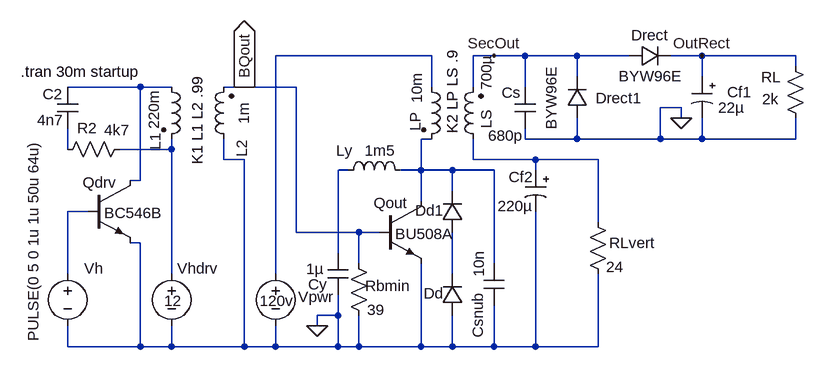
[diagram p0: schematic FlybackTvCtc184.asc]
FlybackTvCtc184.asc, the LTspice schematic file:
Version 4
SHEET 1 880 680
WIRE -1152 -208 -1392 -208
WIRE -1056 -208 -1088 -208
WIRE -1008 -208 -1056 -208
WIRE -928 -208 -1008 -208
WIRE -848 -208 -928 -208
WIRE -736 -208 -784 -208
WIRE -592 -208 -736 -208
WIRE -592 -192 -592 -208
WIRE -928 -176 -928 -208
WIRE -736 -176 -736 -208
WIRE -1600 -160 -1712 -160
WIRE -1552 -160 -1600 -160
WIRE -1440 -160 -1472 -160
WIRE -1360 -160 -1440 -160
WIRE -1152 -160 -1152 -208
WIRE -1088 -160 -1088 -208
WIRE -1008 -160 -1008 -208
WIRE -768 -128 -800 -128
WIRE -768 -112 -768 -128
WIRE -1152 -80 -1168 -80
WIRE -1008 -80 -1008 -96
WIRE -928 -80 -928 -112
WIRE -928 -80 -1008 -80
WIRE -800 -80 -800 -128
WIRE -800 -80 -928 -80
WIRE -736 -80 -736 -112
WIRE -736 -80 -800 -80
WIRE -592 -80 -592 -112
WIRE -592 -80 -736 -80
WIRE -1712 -64 -1712 -96
WIRE -1552 -64 -1552 -80
WIRE -1552 -64 -1632 -64
WIRE -1472 -48 -1472 -80
WIRE -1440 -48 -1472 -48
WIRE -1088 -48 -1088 -80
WIRE -992 -48 -1088 -48
WIRE -896 -48 -992 -48
WIRE -1280 -32 -1296 -32
WIRE -1168 -32 -1168 -80
WIRE -1168 -32 -1200 -32
WIRE -1120 -32 -1168 -32
WIRE -1056 -32 -1120 -32
WIRE -992 -32 -992 -48
WIRE -1600 -16 -1600 -160
WIRE -1600 -16 -1616 -16
WIRE -1120 0 -1120 -32
WIRE -1168 16 -1168 -32
WIRE -1680 32 -1712 32
WIRE -896 48 -896 -48
WIRE -1360 64 -1360 -160
WIRE -1264 64 -1360 64
WIRE -1232 64 -1264 64
WIRE -1600 80 -1616 80
WIRE -1296 96 -1296 -32
WIRE -1264 112 -1264 64
WIRE -1056 112 -1056 -32
WIRE -1712 128 -1712 32
WIRE -1552 128 -1552 -64
WIRE -1392 128 -1392 -208
WIRE -1120 128 -1120 64
WIRE -1296 192 -1296 160
WIRE -1296 192 -1328 192
WIRE -1328 208 -1328 192
WIRE -1712 240 -1712 208
WIRE -1600 240 -1600 80
WIRE -1600 240 -1712 240
WIRE -1552 240 -1552 208
WIRE -1552 240 -1600 240
WIRE -1440 240 -1440 -48
WIRE -1440 240 -1552 240
WIRE -1392 240 -1392 208
WIRE -1392 240 -1440 240
WIRE -1296 240 -1296 192
WIRE -1296 240 -1392 240
WIRE -1264 240 -1264 192
WIRE -1264 240 -1296 240
WIRE -1168 240 -1168 112
WIRE -1168 240 -1264 240
WIRE -1120 240 -1120 192
WIRE -1120 240 -1168 240
WIRE -1056 240 -1056 176
WIRE -1056 240 -1120 240
WIRE -992 240 -992 32
WIRE -992 240 -1056 240
WIRE -896 240 -896 128
WIRE -896 240 -992 240
FLAG -736 -208 OutRect
FLAG -768 -112 0
FLAG -1056 -208 SecOut
FLAG -1440 -160 BQout
IOPIN -1440 -160 Out
FLAG -1328 208 0
SYMBOL voltage -1392 112 M0
WINDOW 0 -62 67 Bottom 0
WINDOW 3 -2 73 Bottom 0
WINDOW 123 41 81 Top 0
SYMATTR InstName Vpwr
SYMATTR Value 120v
SYMATTR SpiceLine Rser=1m Cpar=1m
SYMBOL res -1280 96 R0
WINDOW 0 96 50 Right 0
WINDOW 3 56 87 Right 0
SYMATTR InstName Rbmin
SYMATTR Value 39
SYMATTR SpiceLine tol=1 pwr=0.1
SYMBOL polcap -720 -176 M0
WINDOW 3 -9 48 Right 0
WINDOW 0 -23 24 Right 0
SYMATTR Value 22µ
SYMATTR InstName Cf1
SYMATTR Description Capacitor
SYMATTR Type cap
SYMATTR SpiceLine V=25 Irms=470m Rser=0.16 MTBF=2000 Lser=0 mfg="Nichicon" pn="UPR1E471MPH" type="Al electrolytic" ppPkg=1
SYMBOL cap -1072 112 R0
WINDOW 0 -9 115 VLeft 0
WINDOW 3 -7 21 VLeft 0
SYMATTR InstName Csnub
SYMATTR Value 10n
SYMBOL ind2 -1168 -176 R0
WINDOW 0 -9 55 VRight 0
WINDOW 3 -7 -6 VRight 0
SYMATTR InstName LP
SYMATTR Value 10m
SYMATTR Type ind
SYMATTR SpiceLine Rser=1 Rpar=1430 Cpar=170p
SYMBOL ind2 -1072 -64 R180
WINDOW 0 -4 32 VRight 0
WINDOW 3 -4 91 VRight 0
SYMATTR InstName LS
SYMATTR Value 700µ
SYMATTR Type ind
SYMATTR SpiceLine Rser=.1
SYMBOL diode -848 -192 R270
WINDOW 0 32 32 VTop 0
WINDOW 3 0 32 VBottom 0
SYMATTR InstName Drect
SYMATTR Value BYW96E
SYMBOL npn3 -1232 16 R0
WINDOW 3 24 50 Left 0
WINDOW 0 -9 3 Left 0
SYMATTR Value BU508A
SYMATTR InstName Qout
SYMBOL cap -1024 -160 R0
WINDOW 0 9 9 Right 0
WINDOW 3 13 75 Right 0
SYMATTR InstName Cs
SYMATTR Value 680p
SYMBOL res -608 -208 R0
WINDOW 0 -37 33 Left 0
WINDOW 3 -35 67 Left 0
SYMATTR InstName RL
SYMATTR Value 2k
SYMBOL diode -1104 192 R180
WINDOW 0 29 34 Left 0
WINDOW 3 38 -87 Invisible 0
SYMATTR InstName Dd
SYMATTR Value BYW96E
SYMBOL ind -1296 -16 R270
WINDOW 0 62 10 VBottom 0
WINDOW 3 62 65 VBottom 0
SYMATTR InstName Ly
SYMATTR Value 1m5
SYMATTR SpiceLine Ipk=10 Rser=1 Rpar=100k Cpar=5p
SYMBOL cap -1312 96 R0
WINDOW 0 -30 48 Left 0
WINDOW 3 -33 24 Left 0
SYMATTR InstName Cy
SYMATTR Value 1µ
SYMATTR SpiceLine V=50 Irms=6.038 Rser=0.017 MTBF=0 Lser=0 mfg="KEMET" pn="C1210C105K5RAC" type="X7R" ppPkg=1
SYMBOL ind2 -1568 -176 R0
WINDOW 0 -9 86 VRight 0
WINDOW 3 -11 21 VRight 0
SYMATTR InstName L1
SYMATTR Value 220m
SYMATTR Type ind
SYMATTR SpiceLine Rser=100 Rpar=1430 Cpar=170p
SYMBOL ind2 -1456 -64 R180
WINDOW 0 -12 -12 VRight 0
WINDOW 3 -15 38 VRight 0
SYMATTR InstName L2
SYMATTR Value 1m
SYMATTR Type ind
SYMATTR SpiceLine Rser=1m
SYMBOL npn3 -1680 -16 R0
WINDOW 3 24 50 Left 0
WINDOW 0 -9 3 Left 0
SYMATTR Value BC546B
SYMATTR InstName Qdrv
SYMBOL voltage -1712 112 M0
WINDOW 0 -40 23 Bottom 0
WINDOW 3 68 -35 VBottom 0
WINDOW 123 41 81 Top 0
SYMATTR InstName Vh
SYMATTR Value PULSE(0 5 0 1u 1u 50u 64u)
SYMATTR SpiceLine Rser=1k
SYMBOL cap -1728 -160 R0
WINDOW 0 -22 11 Left 0
WINDOW 3 -31 51 Left 0
SYMATTR InstName C2
SYMATTR Value 4n7
SYMBOL res -1616 -80 R90
WINDOW 0 -1 66 VBottom 0
WINDOW 3 -29 20 VTop 0
SYMATTR InstName R2
SYMATTR Value 4k7
SYMBOL diode -1104 64 R180
WINDOW 0 29 34 Left 0
WINDOW 3 38 -87 Invisible 0
SYMATTR InstName Dd1
SYMATTR Value BYW96E
SYMBOL voltage -1552 112 M0
WINDOW 0 -40 23 Bottom 0
WINDOW 3 -2 73 Bottom 0
WINDOW 123 41 81 Top 0
SYMATTR InstName Vhdrv
SYMATTR Value 12
SYMATTR SpiceLine Rser=1m Cpar=1m
SYMBOL diode -912 -112 R180
WINDOW 0 -84 31 Left 0
WINDOW 3 56 -18 VRight 0
SYMATTR InstName Drect1
SYMATTR Value BYW96E
SYMBOL polcap -976 -32 M0
WINDOW 3 74 55 Right 0
WINDOW 0 57 11 Right 0
SYMATTR Value 220µ
SYMATTR InstName Cf2
SYMATTR Description Capacitor
SYMATTR Type cap
SYMATTR SpiceLine V=25 Irms=470m Rser=0.16 MTBF=2000 Lser=0 mfg="Nichicon" pn="UPR1E471MPH" type="Al electrolytic" ppPkg=1
SYMBOL res -912 32 R0
WINDOW 0 33 48 Left 0
WINDOW 3 29 85 Left 0
SYMATTR InstName RLvert
SYMATTR Value 24
TEXT -1120 -216 VRight 0 !K2 LP LS .9
TEXT -1512 -40 VLeft 0 !K1 L1 L2 .99
TEXT -1784 -184 Left 0 !.tran 30m startup

The netlist it stands for:
* FlybackTvCtc184.asc
Vpwr N001 0 120v Rser=1m Cpar=1m
Rbmin BQout 0 39 tol=1 pwr=0.1
Cf1 OutRect 0 22µ V=25 Irms=470m Rser=0.16 MTBF=2000 Lser=0 mfg="Nichicon" pn="UPR1E471MPH" type="Al electrolytic" ppPkg=1
Csnub N003 0 10n
LP N001 N003 10m Rser=1 Rpar=1430 Cpar=170p
LS N006 SecOut 700µ Rser=.1
Drect SecOut OutRect BYW96E
Qout N003 BQout 0 0 BU508A
Cs SecOut 0 680p
RL OutRect 0 2k
Dd 0 N009 BYW96E
Ly N007 N003 1m5 Ipk=10 Rser=1 Rpar=100k Cpar=5p
Cy N007 0 1µ V=50 Irms=6.038 Rser=0.017 MTBF=0 Lser=0 mfg="KEMET" pn="C1210C105K5RAC" type="X7R" ppPkg=1
L1 N002 N005 220m Rser=100 Rpar=1430 Cpar=170p
L2 0 BQout 1m Rser=1m
Qdrv N002 N008 0 0 BC546B
Vh N008 0 PULSE(0 5 0 1u 1u 50u 64u) Rser=1k
C2 N002 N004 4n7
R2 N005 N004 4k7
Dd1 N009 N003 BYW96E
Vhdrv N005 0 12 Rser=1m Cpar=1m
Drect1 0 SecOut BYW96E
Cf2 N006 0 220µ V=25 Irms=470m Rser=0.16 MTBF=2000 Lser=0 mfg="Nichicon" pn="UPR1E471MPH" type="Al electrolytic" ppPkg=1
RLvert N006 0 24
.model D D
.lib standard.dio
.model NPN NPN
.model PNP PNP
.lib standard.bjt
K2 LP LS .9
K1 L1 L2 .99
.tran 30m startup
.backanno
.end